# Altium schematic sheet SPI_IO.SchDoc
size A4
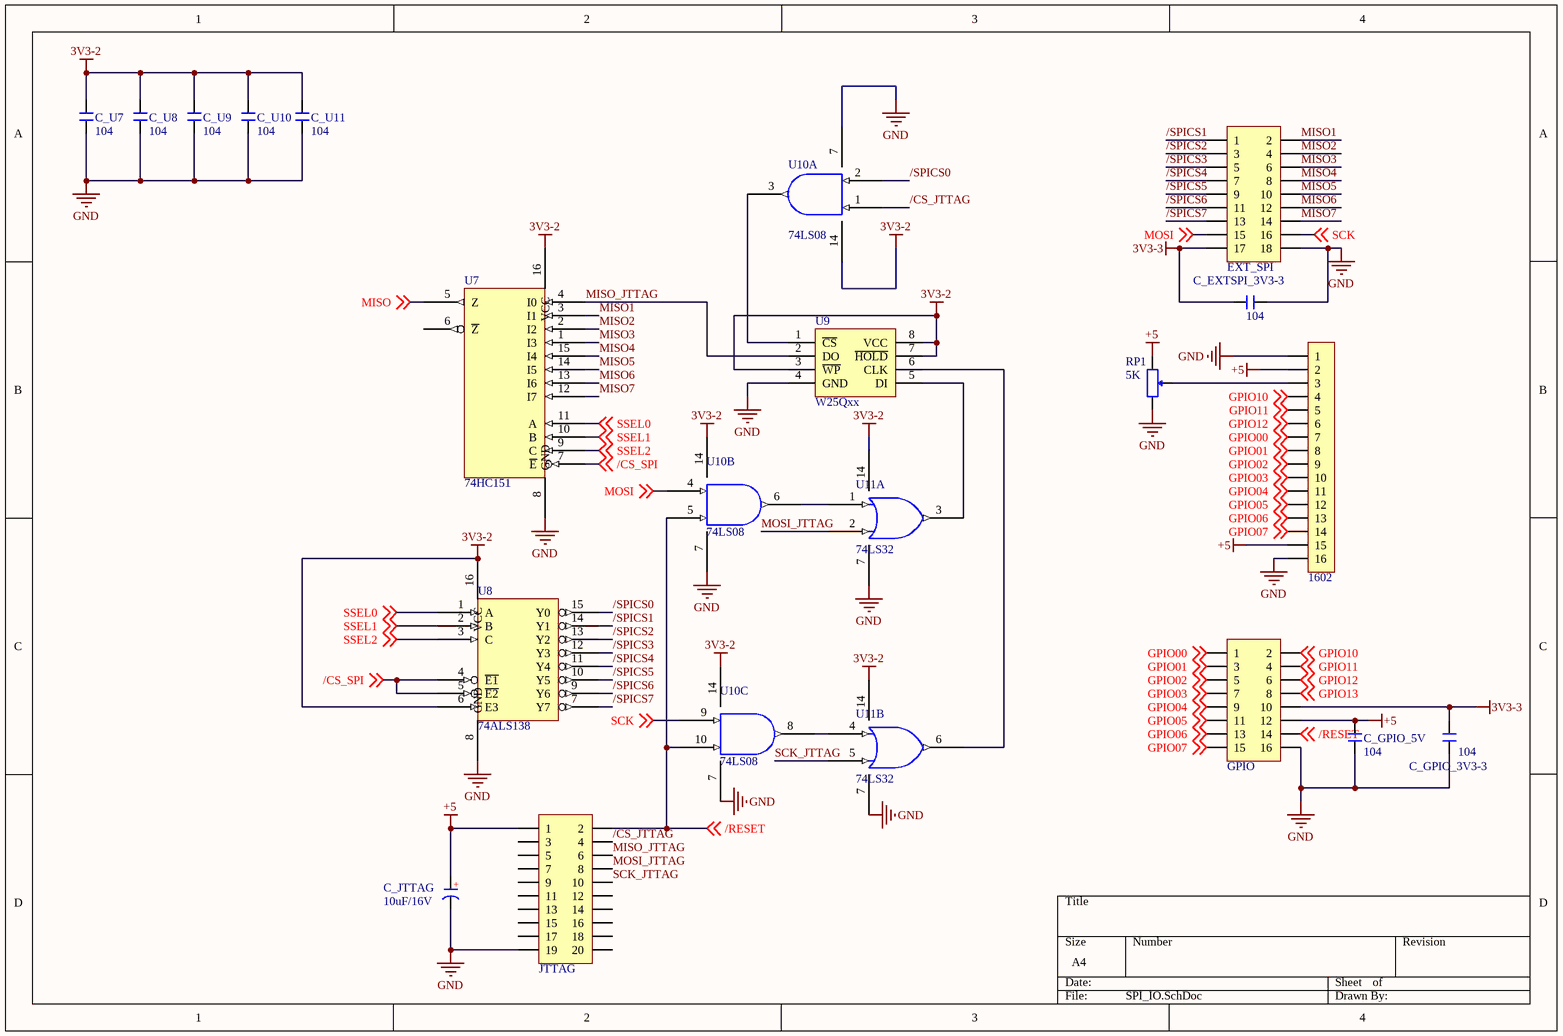
[diagram p0: SPI_IO.SchDoc]

## Parts
1602  HDR-1X16  [SIP16]  (value not drawn)
C_EXTSPI_3V3-3  104  [0805]
C_GPIO_3V3-3  104  [0805]
C_GPIO_5V  104  [0805]
C_JTTAG  10uF/16V  [RB.1/.2]
C_U7  104  [0805]
C_U8  104  [0805]
C_U9  104  [0805]
C_U10  104  [0805]
C_U11  104  [0805]
EXT_SPI  Header 9X2  [HDR2X9]  (value not drawn)
GPIO  Header 8X2  [HDR2X8]  (value not drawn)
JTTAG  Header 2X10  [IDC2.54-V20D]  (value not drawn)
RP1  5K  [3303W]
U7  74HC151  [SO-16]
U8  74ALS138  [SO-16]
U9  W25Qxx  [SOIC-8]
U10  74LS08  [SO-14]  (parts A,B,C of 4)
U11  74LS32  [SO-14]  (parts A,B of 4)

## Nets
3V3-2: C_U7.2 C_U8.2 C_U9.2 C_U10.2 C_U11.2 U7.16(VCC) U8.6(E3) U8.16(VCC) U9.3(~{WP}) U9.7(~{HOLD}) U9.8(VCC) U10.14(VCC) U11.14(VCC)  [also labelled VCC]
3V3-3: C_EXTSPI_3V3-3.1 C_GPIO_3V3-3.2 EXT_SPI.17 GPIO.10
+5: 1602.2 1602.15 C_GPIO_5V.2 C_JTTAG.1(A) GPIO.12 JTTAG.1 RP1.1
GND: 1602.1 1602.16 C_EXTSPI_3V3-3.2 C_GPIO_3V3-3.1 C_GPIO_5V.1 C_JTTAG.2(K) C_U7.1 C_U8.1 C_U9.1 C_U10.1 C_U11.1 EXT_SPI.18 GPIO.16 JTTAG.19 RP1.3 U7.8(GND) U8.8(GND) U9.4(GND) U10.7(GND) U11.7(GND)
/CS_JTTAG: JTTAG.4 U10.1
/CS_SPI: U7.7(~{E}) U8.4(~{E1}) U8.5(~{E2}) ; off-sheet /CS_SPI
/RESET: GPIO.14 JTTAG.2 U10.5 U10.10 ; off-sheet /RESET
/SPICS0: U8.15(Y0) U10.2
/SPICS1: EXT_SPI.1 U8.14(Y1)
/SPICS2: EXT_SPI.3 U8.13(Y2)
/SPICS3: EXT_SPI.5 U8.12(Y3)
/SPICS4: EXT_SPI.7 U8.11(Y4)
/SPICS5: EXT_SPI.9 U8.10(Y5)
/SPICS6: EXT_SPI.11 U8.9(Y6)
/SPICS7: EXT_SPI.13 U8.7(Y7)
GPIO00: 1602.7 GPIO.1 ; off-sheet GPIO00
GPIO01: 1602.8 GPIO.3 ; off-sheet GPIO01
GPIO02: 1602.9 GPIO.5 ; off-sheet GPIO02
GPIO03: 1602.10 GPIO.7 ; off-sheet GPIO03
GPIO04: 1602.11 GPIO.9 ; off-sheet GPIO04
GPIO05: 1602.12 GPIO.11 ; off-sheet GPIO05
GPIO06: 1602.13 GPIO.13 ; off-sheet GPIO06
GPIO07: 1602.14 GPIO.15 ; off-sheet GPIO07
GPIO10: 1602.4 GPIO.2 ; off-sheet GPIO10
GPIO11: 1602.5 GPIO.4 ; off-sheet GPIO11
GPIO12: 1602.6 GPIO.6 ; off-sheet GPIO12
GPIO13: GPIO.8 ; off-sheet GPIO13
MISO: U7.5(Z) ; off-sheet MISO
MISO1: EXT_SPI.2 U7.3(I1)
MISO2: EXT_SPI.4 U7.2(I2)
MISO3: EXT_SPI.6 U7.1(I3)
MISO4: EXT_SPI.8 U7.15(I4)
MISO5: EXT_SPI.10 U7.14(I5)
MISO6: EXT_SPI.12 U7.13(I6)
MISO7: EXT_SPI.14 U7.12(I7)
MISO_JTTAG: JTTAG.6 U7.4(I0) U9.2(DO)
MOSI: EXT_SPI.15 U10.4 ; off-sheet MOSI
MOSI_JTTAG: JTTAG.8 U11.2
SCK: EXT_SPI.16 U10.9 ; off-sheet SCK
SCK_JTTAG: JTTAG.10 U11.5
SSEL0: U7.11(A) U8.1(A) ; off-sheet SSEL0
SSEL1: U7.10(B) U8.2(B) ; off-sheet SSEL1
SSEL2: U7.9(C) U8.3(C) ; off-sheet SSEL2
Net1602_3: 1602.3 RP1.2
NetU9_1: U9.1(~{CS}) U10.3
NetU9_5: U9.5(DI) U11.3
NetU9_6: U9.6(CLK) U11.6
NetU10_6: U10.6 U11.1
NetU10_8: U10.8 U11.4

Not connected (* = marked no-connect by the designer): JTTAG 3 5 7 9 11 12 13 14 15 16 17 18 20; U7 6(~{Z})

## Notes on the sheet
- (in symbol C-CAP) +

## Library data of the parts
1602 = Header 16: 16P接插件; 版权归属: 源创客; BOM名称: 16P接插件; 学习资源: www.ooocke.com
C_EXTSPI_3V3-3 C_GPIO_3V3-3 C_GPIO_5V C_U7-C_U11 = C: 无极性贴片电容; 版权归属: 源创客; BOM名称: 无极性贴片电容; 学习资源: www.ooocke.com
C_JTTAG = C-CAP: 直插电解电容; 版权归属: 源创客; BOM名称: 直插电解电容; 学习资源: www.ooocke.com
EXT_SPI = Header 9X2: 9*2P接插件; 版权归属: 源创客; BOM名称: 9*2P接插件; 学习资源: www.ooocke.com
GPIO = Header 8X2: 8*2P接插件; 版权归属: 源创客; BOM名称: 8*2P接插件; 学习资源: www.ooocke.com
JTTAG = Header 10X2: 10*2P接插件; 版权归属: 源创客; BOM名称: 10*2P接插件; 学习资源: www.ooocke.com
RP1 = RP-SMD: 贴片电位器; 版权归属: 源创客; BOM名称: 贴片电位器; 学习资源: www.ooocke.com
U9 = W25Qxx: 外置Flash; 版权归属: 源创客; BOM名称: 外置Flash; 学习资源: www.ooocke.com